# Altium schematic sheet buckboost.SchDoc
size B
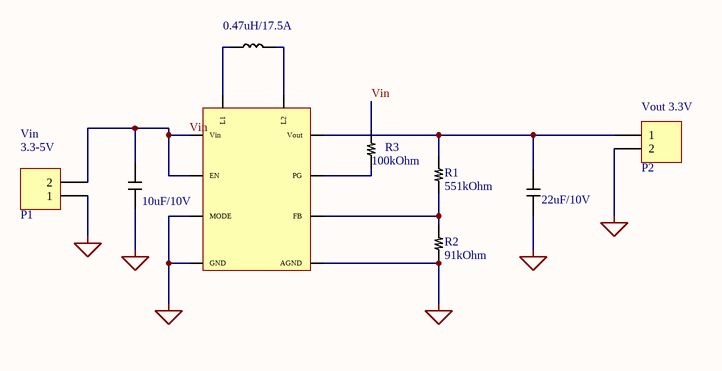
[diagram p0: buckboost.SchDoc]

## Parts
*  TPS63802  [TPS63802]  (value not drawn)
C1  10uF/10V  [cap]
C2  22uF/10V  [cap]
L  0.47uH/17.5A  [coil]
P1  Domino 2  [DOMINO SMALL 2]  (value not drawn)
P2  Domino 2  [DOMINO SMALL 2]  (value not drawn)
R1  551kOhm  [resistor]
R2  91kOhm  [resistor]
R3  100kOhm  [resistor]

## Nets
GND: *.2(MODE) *.3(AGND) *.8(GND) C1.2 C2.1 P1.1 P2.2 R2.1
Vin: *.1(EN) *.10(Vin) C1.1 P1.2 R3.2
Net*_4: *.4(FB) R1.2 R2.2
Net*_5: *.5(PG) R3.1
Net*_6: *.6(Vout) C2.2 P2.1 R1.1
Net*_7: *.7(L2) L.2
Net*_9: *.9(L1) L.1

## Notes on the sheet
- (near P1) 3.3-5V
- (near P1) Vin
- (near P2) Vout 3.3V

## Library data of the parts
C1 C2 = cap
L = coil
P1 P2 = Domino 2: Domino, 2-Pin; LatestRevisionDate: 17-Jul-2002; LatestRevisionNote: Re-released for DXP Platform.; Publisher: Altium Limited
R1-R3 = resistor